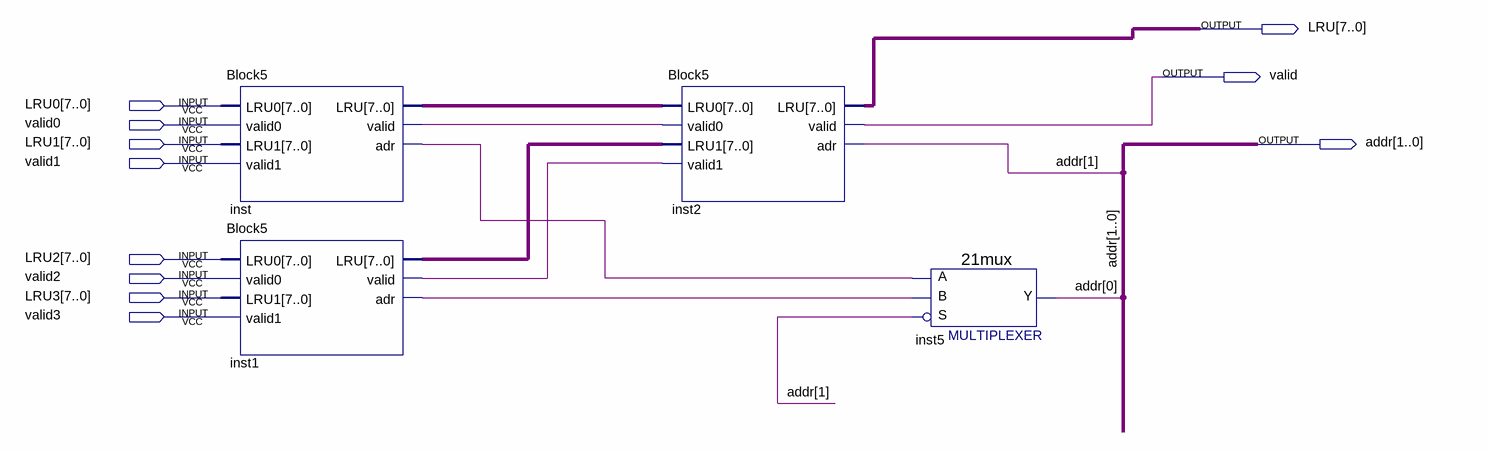
[diagram p0: schematic sheet]
// Quartus schematic CMP4.bdf as structural Verilog: 4 symbols, 11 pins
module CMP4 (
  input  [7:0] LRU0,
  input  valid0,
  input  [7:0] LRU1,
  input  valid1,
  input  [7:0] LRU2,
  input  valid2,
  input  [7:0] LRU3,
  input  valid3,
  output [7:0] LRU,
  output valid,
  output [1:0] addr
);

  wire inst1_adr, inst1_valid, inst_adr, inst_valid;
  wire [7:0] inst1_lru, inst_lru;

  Block5 inst (
    .LRU0(LRU0), .valid0(valid0), .LRU1(LRU1), .valid1(valid1), .LRU(inst_lru), .valid(inst_valid),
    .adr(inst_adr));
  Block5 inst1 (
    .LRU0(LRU2), .valid0(valid2), .LRU1(LRU3), .valid1(valid3), .LRU(inst1_lru), .valid(inst1_valid),
    .adr(inst1_adr));
  Block5 inst2 (
    .LRU0(inst_lru), .valid0(inst_valid), .LRU1(inst1_lru), .valid1(inst1_valid), .LRU(LRU), .valid(valid),
    .adr(addr[1]));
  \21mux  inst5 (.S(~addr[1]), .B(inst1_adr), .A(inst_adr), .Y(addr[0]));
endmodule
